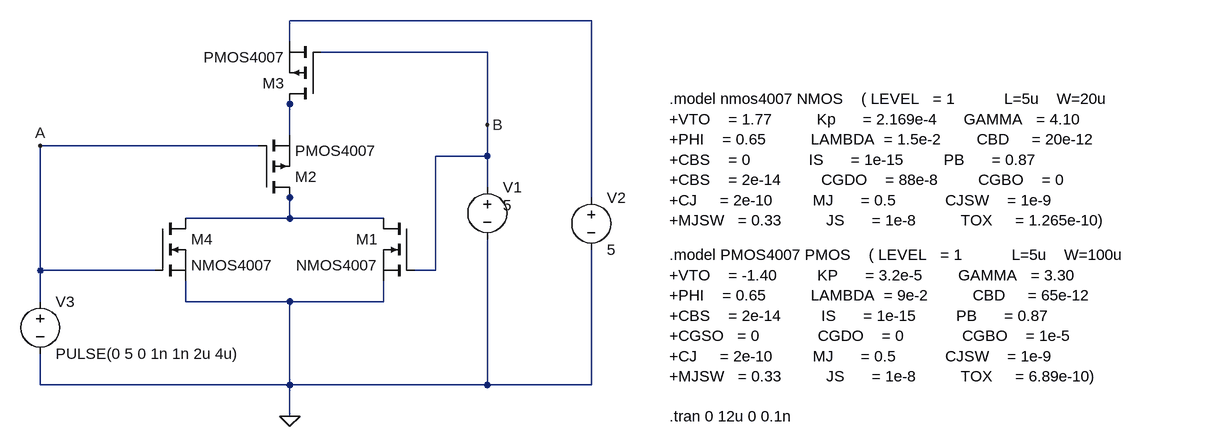
[diagram p0: schematic Practica6.4.asc]
Practica6.4.asc, the LTspice schematic file:
Version 4
SHEET 1 1556 680
WIRE 448 -144 -16 -144
WIRE -16 -112 -16 -144
WIRE 288 -96 32 -96
WIRE -16 -16 -16 -32
WIRE 288 16 288 -96
WIRE -16 32 -16 -16
WIRE -64 48 -400 48
WIRE 288 64 288 16
WIRE 288 64 208 64
WIRE 288 112 288 64
WIRE -16 128 -16 112
WIRE 448 128 448 -144
WIRE -16 160 -16 128
WIRE -16 160 -176 160
WIRE 128 160 -16 160
WIRE -400 240 -400 48
WIRE -224 240 -400 240
WIRE 208 240 208 64
WIRE 208 240 176 240
WIRE -400 288 -400 240
WIRE -176 288 -176 256
WIRE -16 288 -176 288
WIRE 128 288 128 256
WIRE 128 288 -16 288
WIRE -400 416 -400 368
WIRE -16 416 -16 288
WIRE -16 416 -400 416
WIRE 288 416 288 192
WIRE 288 416 -16 416
WIRE 448 416 448 208
WIRE 448 416 288 416
WIRE -16 464 -16 416
FLAG -16 464 0
FLAG -400 48 A
FLAG 288 16 B
SYMBOL nmos 176 160 M0
SYMATTR InstName M1
SYMATTR Value NMOS4007
SYMBOL pmos -64 128 M180
SYMATTR InstName M2
SYMATTR Value PMOS4007
SYMBOL pmos 32 -16 R180
SYMATTR InstName M3
SYMATTR Value PMOS4007
SYMBOL voltage 288 96 R0
WINDOW 3 24 44 Left 2
WINDOW 123 0 0 Left 0
WINDOW 39 0 0 Left 0
SYMATTR Value 5
SYMATTR InstName V1
SYMBOL voltage 448 112 R0
WINDOW 123 0 0 Left 0
WINDOW 39 0 0 Left 0
SYMATTR InstName V2
SYMATTR Value 5
SYMBOL nmos -224 160 R0
SYMATTR InstName M4
SYMATTR Value NMOS4007
SYMBOL voltage -400 272 R0
WINDOW 123 0 0 Left 0
WINDOW 39 0 0 Left 0
SYMATTR InstName V3
SYMATTR Value PULSE(0 5 0 1n 1n 2u 4u)
TEXT 568 -24 Left 2 !.model nmos4007 NMOS    ( LEVEL   = 1           L=5u    W=20u             \n+VTO    = 1.77          Kp      = 2.169e-4      GAMMA   = 4.10  \n+PHI    = 0.65          LAMBDA  = 1.5e-2        CBD     = 20e-12\n+CBS    = 0             IS      = 1e-15         PB      = 0.87\n+CBS    = 2e-14         CGDO    = 88e-8         CGBO    = 0\n+CJ     = 2e-10         MJ      = 0.5           CJSW    = 1e-9\n+MJSW   = 0.33          JS      = 1e-8          TOX     = 1.265e-10)
TEXT 568 216 Left 2 !.model PMOS4007 PMOS    ( LEVEL   = 1           L=5u    W=100u                \n+VTO    = -1.40         KP      = 3.2e-5        GAMMA   = 3.30  \n+PHI    = 0.65          LAMBDA  = 9e-2          CBD     = 65e-12\n+CBS    = 2e-14         IS      = 1e-15         PB      = 0.87\n+CGSO   = 0             CGDO    = 0             CGBO    = 1e-5\n+CJ     = 2e-10         MJ      = 0.5           CJSW    = 1e-9\n+MJSW   = 0.33          JS      = 1e-8          TOX     = 6.89e-10)
TEXT 568 464 Left 2 !.tran 0 12u 0 0.1n

The netlist it stands for:
* Practica6.4.asc
M1 N003 B 0 0 NMOS4007
M2 N003 A N002 N002 PMOS4007
M3 N002 B N001 N001 PMOS4007
V1 B 0 5
V2 N001 0 5
M4 N003 A 0 0 NMOS4007
V3 A 0 PULSE(0 5 0 1n 1n 2u 4u)
.model NMOS NMOS
.model PMOS PMOS
.lib standard.mos
.model nmos4007 NMOS    ( LEVEL   = 1           L=5u    W=20u
+VTO    = 1.77          Kp      = 2.169e-4      GAMMA   = 4.10
+PHI    = 0.65          LAMBDA  = 1.5e-2        CBD     = 20e-12
+CBS    = 0             IS      = 1e-15         PB      = 0.87
+CBS    = 2e-14         CGDO    = 88e-8         CGBO    = 0
+CJ     = 2e-10         MJ      = 0.5           CJSW    = 1e-9
+MJSW   = 0.33          JS      = 1e-8          TOX     = 1.265e-10)
.model PMOS4007 PMOS    ( LEVEL   = 1           L=5u    W=100u
+VTO    = -1.40         KP      = 3.2e-5        GAMMA   = 3.30
+PHI    = 0.65          LAMBDA  = 9e-2          CBD     = 65e-12
+CBS    = 2e-14         IS      = 1e-15         PB      = 0.87
+CGSO   = 0             CGDO    = 0             CGBO    = 1e-5
+CJ     = 2e-10         MJ      = 0.5           CJSW    = 1e-9
+MJSW   = 0.33          JS      = 1e-8          TOX     = 6.89e-10)
.tran 0 12u 0 0.1n
.backanno
.end